# Altium schematic sheet main.SchDoc
size A4
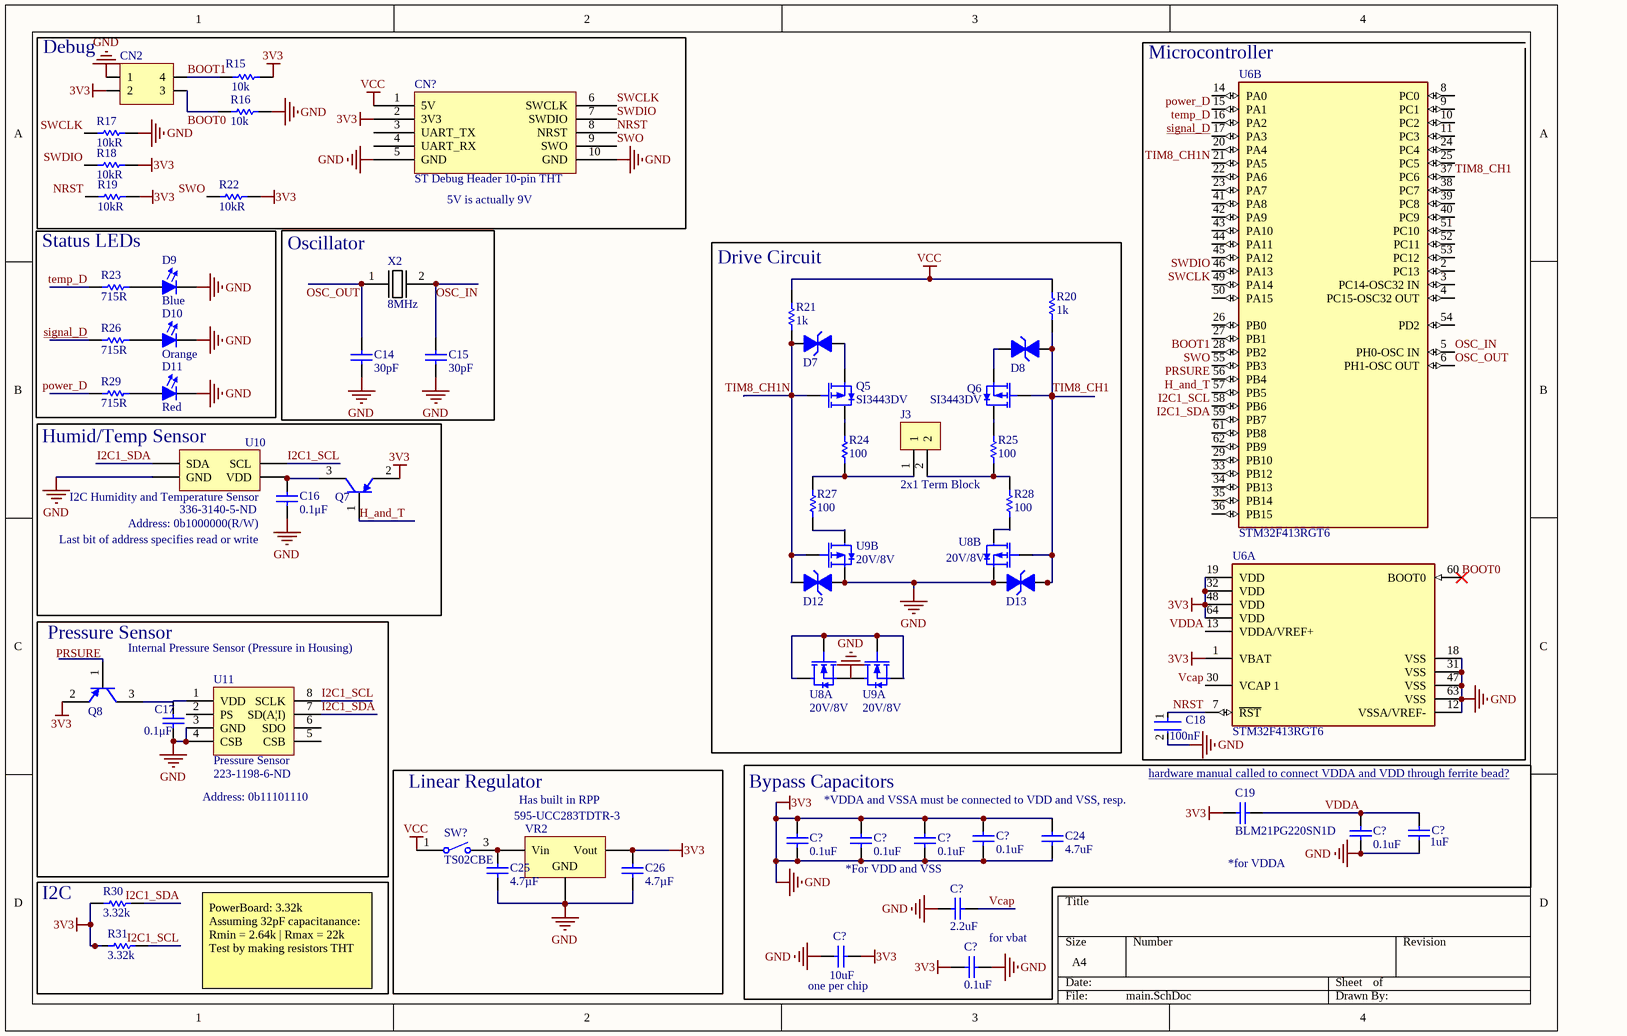
[diagram p0: main.SchDoc]

## Parts
(Parts that share a designator on the sheet are numbered #1, #2 ... from top to bottom, then left to right.)
C14  30pF  [CAPC1608N(0603")]
C15  30pF  [CAPC1608N(0603")]
C16  0.1μF  [CAPC1608N(0603")]
C17  0.1μF  [CAPC1608N(0603")]
C18  Capacitance: 100nF  [FP-CL10-0_1-MFG]  (hidden comment: CL10B104JB8NNNC)
C19  BLM21PG220SN1D  [CAPC2013X105X50ML20T20]
C24  4.7uF  [CAPC1608N(0603")]
C25  4.7µF  [CAPC2012N(0805")]
C26  4.7µF  [CAPC2012N(0805")]
C?#1  Capacitance: 0.1uF  [FP-CL10-0_1-MFG]  (hidden comment: CL10B104JB8NNNC)
C?#2  Capacitance: 1uF  [0803 CAP]  (hidden comment: CL21B105KBFNNNG)
C?#3  Capacitance: 0.1uF  [FP-CL10-0_1-MFG]  (hidden comment: CL10B104JB8NNNC)
C?#4  Capacitance: 0.1uF  [FP-CL10-0_1-MFG]  (hidden comment: CL10B104JB8NNNC)
C?#5  Capacitance: 0.1uF  [FP-CL10-0_1-MFG]  (hidden comment: CL10B104JB8NNNC)
C?#6  Capacitance: 0.1uF  [FP-CL10-0_1-MFG]  (hidden comment: CL10B104JB8NNNC)
C?#7  2.2uF  [CAPC1608N(0603")]
C?#8  Capacitance: 10uF  [CAPC3216X180X50LL20T30]  (hidden comment: CL31B106KBHNNNE)
C?#9  Capacitance: 0.1uF  [FP-CL10-0_1-MFG]  (hidden comment: CL10B104JB8NNNC)
CN2  Header, Male, 2x2, Pitch: 0.1" (2.54mm), THT  [Header, Male, 2x2, Pitch: 0.1" (2.54mm),THT]  (value not drawn)
CN?  ST Debug Header 10-pin THT  [10-pin shrouded header THT]
D7  SMBJ24CA  [DO-214AC]  (value not drawn)
D8  SMBJ24CA  [DO-214AC]  (value not drawn)
D9  Blue  [LED0805]
D10  Orange  [LED0805]
D11  Red  [LED0805]
D12  SMBJ24CA  [DO-214AC]  (value not drawn)
D13  SMBJ24CA  [DO-214AC]  (value not drawn)
J3  2x1 Term Block  [2X1 Terminal Blocks Phoenix Contact 5mm]
Q5  SI3443DV  [SuperSOT-6]
Q6  SI3443DV  [SuperSOT-6]
Q7  MMBT3906LT3G  [ONSC-SOT-23-3-318-08_V]  (value not drawn)
Q8  MMBT3906LT3G  [ONSC-SOT-23-3-318-08_V]  (value not drawn)
R15  10k  [RESC1608N(0603")]
R16  10k  [RESC1608N(0603")]
R17  10kR  [RESC1608N(0603")]
R18  10kR  [RESC1608N(0603")]
R19  10kR  [RESC1608N(0603")]
R20  1k  [RESC1608N(0603")]
R21  1k  [RESC1608N(0603")]
R22  10kR  [RESC1608N(0603")]
R23  715R  [RESC1608N(0603")]
R24  100  [RESC1608N(0603")]
R25  100  [RESC1608N(0603")]
R26  715R  [RESC1608N(0603")]
R27  100  [RESC1608N(0603")]
R28  100  [RESC1608N(0603")]
R29  715R  [RESC1608N(0603")]
R30  3.32k  [RESC1608N(0603")]
R31  3.32k  [RESC1608N(0603")]
SW?  TS02CBE  [CKCP-TS02CBE_V]
U6  STM32F413RGT6  [FP-LQFP64-5W-MFG]  (parts A,B of 2)
U8  20V/8V  [SOT-363]  (parts A,B of 2)
U9  20V/8V  [SOT-363]  (parts A,B of 2)
U10  I2C Humidity and Temperature Sensor  Supplier Part Number 1: 336-3140-5-ND  [QFN-6]
U11  Pressure Sensor  Supplier Part Number 1: 223-1198-6-ND  [TE Pressure Sensor (MS560702BA03-50)]
VR2  595-UCC283TDTR-3  [D2PAK_N]
X2  8MHz  [HC49/US]

## Blocks framed on the sheet
Debug: CN2 CN? R15-R19 R22
Status LEDs: D9-D11 R23 R26 R29
Oscillator: C14 C15 X2
Drive Circuit: D7 D8 D12 D13 J3 Q5 Q6 R20 R21 R24 R25 R27 R28 U8 U9
Humid/Temp Sensor: C16 Q7 U10
Pressure Sensor: C17 Q8 U11
Linear Regulator: C25 C26 SW? VR2
Bypass Capacitors: C19 C24 C?#1-C?#9
I2C: R30 R31

## Nets
3V3: C14.1 C15.1 C16.1(Anode) C17.1(Anode) C18.2 C19.1 C24.1(Anode) C24.2(Cathode) C25.1(Anode) C26.1(Anode) C26.2(Cathode) C?#1.1 C?#1.2 C?#2.1 C?#3.1 C?#4.1 C?#4.2 C?#5.1 C?#6.1 C?#6.2 C?#7.1(Anode) C?#8.1 C?#8.2 C?#9.1 C?#9.2 CN2.1 CN2.2 CN?.2(3V3) CN?.5(GND) CN?.10(GND) D9.1(Cathode) D10.1(Cathode) D11.1(Cathode) D12.2(Cathode) D13.2(Cathode) Q7.2(E) Q8.2(E) R15.1 R16.1 R17.2 R18.2 R19.2 R22.2 R30.1 R31.1 U6.1(VBAT) U6.12(VSSA/VREF-) U6.18(VSS) U6.19(VDD) U6.31(VSS) U6.32(VDD) U6.47(VSS) U6.48(VDD) U6.63(VSS) U6.64(VDD) U8.1(S1) U8.4(S2) U9.4(S2) U10.2(GND) U11.3(GND) U11.4(CSB) VR2.2(GND) VR2.3(Vout)  [also labelled GND]
VCC: CN?.1(5V) R20.2 R21.2 SW?.1
BOOT0: CN2.3 R16.2 U6.60(BOOT0)
BOOT1: CN2.4 R15.2 U6.28(PB2)
H_and_T: Q7.1(B) U6.57(PB5)
I2C1_SCL: R31.2 U6.58(PB6) U10.6(SCL) U11.8(SCLK)
I2C1_SDA: R30.2 U6.59(PB7) U10.1(SDA) U11.7(SD(A|I))
NRST: C18.1 CN?.8(NRST) R19.1 U6.7(~{RST})
OSC_IN: C15.2 U6.5(PH0-OSC_IN) X2.2
OSC_OUT: C14.2 U6.6(PH1-OSC_OUT) X2.1
power_D: R29.1 U6.15(PA1)
PRSURE: Q8.1(B) U6.56(PB4)
signal_D: R26.1 U6.17(PA3)
SWCLK: CN?.6(SWCLK) R17.1 U6.49(PA14)
SWDIO: CN?.7(SWDIO) R18.1 U6.46(PA13)
SWO: CN?.9(SWO) R22.1 U6.55(PB3)
temp_D: R23.1 U6.16(PA2)
TIM8_CH1: D8.2(Cathode) D13.1(Anode) Q6.3 R20.1 U6.37(PC6) U8.5(G2)
TIM8_CH1N: D7.2(Cathode) D12.1(Anode) Q5.3 R21.1 U6.21(PA5) U9.5(G2)
Vcap: C?#7.2(Cathode) U6.30(VCAP_1)
VDDA: C19.2 C?#2.2 C?#3.2 U6.13(VDDA/VREF+)
NetC16_2: C16.2(Cathode) Q7.3(C) U10.5(VDD)
NetC17_2: C17.2(Cathode) Q8.3(C) U11.1(VDD)
NetC25_2: C25.2(Cathode) SW?.3 VR2.1(Vin)
NetD7_1: D7.1(Anode) Q5.1
NetD8_1: D8.1(Anode) Q6.1
NetD9_2: D9.2(Anode) R23.2
NetD10_2: D10.2(Anode) R26.2
NetD11_2: D11.2(Anode) R29.2
NetJ3_1: J3.1 R24.1 R27.2
NetJ3_2: J3.2 R25.1 R28.2
NetQ5_4: Q5.4 R24.2
NetQ6_4: Q6.4 R25.2
NetR27_1: R27.1 U9.3(D2)
NetR28_1: R28.1 U8.3(D2)
NetU8_2: U8.2(G1) U8.6(D1) U9.1(S1) U9.2(G1)

Not connected (* = marked no-connect by the designer): C?#5 2; CN? 3(UART_TX) 4(UART_RX); U6 2(PC13) 3(PC14-OSC32_IN) 4(PC15-OSC32_OUT) 8(PC0) 9(PC1) 10(PC2) 11(PC3) 14(PA0) 20(PA4) 22(PA6) 23(PA7) 24(PC4) 25(PC5) 26(PB0) 27(PB1) 29(PB10) 33(PB12) 34(PB13) 35(PB14) 36(PB15) 38(PC7) 39(PC8) 40(PC9) 41(PA8) 42(PA9) 43(PA10) 44(PA11) 45(PA12) 50(PA15) 51(PC10) 52(PC11) 53(PC12) 54(PD2) 61(PB8) 62(PB9); U9 6(D1); U11 2(PS) 5(CSB) 6(SDO)

## Notes on the sheet
- (near U6) Microcontroller
- (near CN?) 5V is actually 9V
- (near C16) Last bit of address specifies read or write
- (near C16) Address: 0b1000000(R/W)
- Internal Pressure Sensor (Pressure in Housing)
- hardware manual called to connect VDDA and VDD through ferrite bead? <https://www.st.com/resource/en/application_note/dm00115714-getting-started-with-stm32f4xxxx-mcu-hardware-development-stmicroelectronics.pdf>
- Address: 0b11101110
- Has built in RPP
- *VDDA and VSSA must be connected to VDD and VSS, resp.
- (near C?#4) *For VDD and VSS
- (near C19) *for VDDA
- PowerBoard: 3.32k
  Assuming 32pF capacitanance:
  Rmin = 2.64k | Rmax = 22k
  Test by making resistors THT
- (near C?#8) one per chip
- (near C?#9) for vbat

## Library data of the parts
C14 C15 = CMP-006-0040-1: Capacitor, Ceramic, 50V, +/-1%, 0603 SMD, C0G; Made By: Andy Bates; Design Item ID: 30pF 50V 0603 SMD, Ceramic; Value: 30pF; PackageDescription: Chip Capacitor; Source: AUVic_Schematic_Library_Capacitors.SchLib; Publisher: AUVic; Pin Count: 2; Published: 16-09-12; Component Type: Standard
C16 C17 = 0.1uF 100V 0603 SMD, Ceramic: Capacitor, Ceramic, 100V, +/- 10%, 0603 SMD, X7R; MFG: TDK; MFG#: CGA3E3X7S2A104K080AB; Published: 16-04-26; Publisher: AUVic; PackageDescription: Chip Capacitor; Value: 0.1μF; Created By: Ashwin Sira; Supplier 1: Digi-Key; Supplier Part Number 1: 445-6938-1-ND
C18 = CMP-00000-1: CAP CER 0.1UF 50V X7R 0603; Material: Ceramic; Tolerance: 5%; Dielectric: X7R; Width: 0.031inch; Min Operating Temperature: -55°C; Contact Plating: Tin; Length: 1.6mm; Case/Package: 0603; Package Quantity: 1; Voltage Rating: 50V; Radiation Hardening: No; Packaging: Tape and Reel; Max Operating Temperature: 125°C; Case Code (Imperial): 0603; Thickness: 0.035inch; Case Code (Metric): 1608; Height: 0.8mm; Mount: Surface Mount; Depth: 0.8mm
C19 = CMP-2007-03669-1: Manufacturer: Murata; Part Number: BLM21PG220SN1D
C24 = CMP-006-0043-1: Capacitor, Ceramic, 10V, +/- 10%, 0603 SMD, X5R; Value: 4.7µF; MFG: Samsung; MFG#: GRM188R61A475KE15D; PackageDescription: Chip Capacitor; Source: AUVic_Schematic_Library_Capacitors.SchLib; Published: 16-06-23; Created By: Ashwin Sira; Component Type: Standard; Pin Count: 2; Publisher: AUVic; Design Item ID: 4.7uF 10V 0603 SMD, Ceramic
C25 C26 = 4.7uF 35V 0805 SMD, Ceramic: Capacitor, Ceramic, 35V, +/- 10%, 0805 SMD, X5R; Made By: Andy Bates; Published: 16-11-12; Publisher: AUVic; PackageDescription: Chip Capacitor; Value: 4.7µF; Supplier 1: Digi-Key; Supplier Part Number 1: 1276-6722-1-ND
C?#1 C?#3-C?#6 C?#9 = CMP-00000-3: CAP CER 0.1UF 50V X7R 0603; Tolerance: 5%; Material: Ceramic; Case Code (Imperial): 0603; Mount: Surface Mount; Thickness: 0.035inch; Depth: 0.8mm; Packaging: Tape and Reel; Package Quantity: 1; Dielectric: X7R; Height: 0.8mm; Voltage: 50V; Radiation Hardening: No; Max Operating Temperature: 125°C; Voltage Rating: 50V; Case/Package: 0603; Min Operating Temperature: -55°C; Case Code (Metric): 1608; Length: 1.6mm; Contact Plating: Tin; Width: 0.031inch
C?#2 = CMP-00005-1: SAMSUNG ELECTRO-MECHANICS - CL21B105KBFNNNG - MLCC CAPACITORS; Tolerance: 10%; Voltage Rating: 50V; Material: Ceramic; Dielectric: X7R; Case/Package: 0805; Contact Plating: Tin; Max Operating Temperature: 125°C; Termination: Wraparound; Package Quantity: 3000; Depth: 1.25mm; Mount: Surface Mount; Min Operating Temperature: -55°C; Thickness: 0.053inch; Packaging: Tape and Reel; Case Code (Metric): 2012; Length: 2mm; Case Code (Imperial): 0805; Width: 0.049inch
C?#7 = CMP-006-0030-1: Capacitor, Ceramic, 50V, 10%, 0603 SMD, X5R; Value: 2.2µF; Date Created: *; Design Item ID: 2.2uF, 50V, 0603 SMD, X5R, Ceramic; Made By: *; Publisher: AUVic; Source: AUVic_Schematic_Library_Capacitors.SchLib; Pin Count: 2; PackageDescription: Chip Capacitor; Component Type: Standard
C?#8 = CMP-00004-1: Cap Ceramic 10uF 50V X7R 10% Pad SMD 1206 125°C T/R; Thickness: 0.071inch; Case/Package: 1206; Case Code (Metric): 3216; Case Code (Imperial): 1206; Voltage Rating: 50V; Length: 0.126inch; Max Operating Temperature: 125°C; Voltage Rating (DC): 50V; Dielectric: X7R; Lead Free: Lead Free; Min Operating Temperature: -55°C; Tolerance: 10%; Mount: Surface Mount; Packaging: Tape and Reel; Width: 0.063inch
CN2 = CMP-005-0036-1: Pin Count: 4; Date Published: 2018-01-27; Last Updated: *; Source: AUVic_Schematic_Library_Connectors.SchLib; Design Item ID: Header, Male, 2x2, Pitch: 0.1" (2.54mm), THT; Publisher: AUVic; Reviewed By: *; Created By: Lyden Smith; Component Type: Standard
CN? = CMP-00011-5: CONN HEADER VERT 10POS 2.54MM; Row Spacing: 0.1inch; Connector Type: Male Pin; Number of Positions: 10; Packaging: Tray; Package Quantity: 1; Color: Black; Number of Rows: 2; Termination: Solder; Contact Plating: Gold; Lead Free: Lead Free; Pitch: 0.1inch; Mount: Through Hole
D7 D8 D12 D13 = SMBJ24CA: TVS DIODE 24VWM 38.9VC SMB; Manufacturer: Fairchild Semiconductor; Type: Zener; Bidirectional Channels: 1; Voltage - Reverse Standoff (Typ): 24V; Voltage - Breakdown (Min): 26.7V; Voltage - Clamping (Max) @ Ipp: 38.9V; Current - Peak Pulse (10/1000µs): 15.4A; Power - Peak Pulse: 600W; Power Line Protection: No; Supplier 1: Digi-Key; Manufacturer Part Number: SMBJ24CA; RoHS: RoHS Compliant; Category: Circuit Protection; Stock 1: 31873; Pricing 1: 1=0.58, 10=0.411, 25=0.3372, 100=0.2695, 250=0.19636, 500=0.15946, 1000=0.12257 (USD); Packaging: Cut Tape (CT); Unidirectional Channels: -; Applications: General Purpose; Capacitance @ Frequency: -; Operating Temperature: -55°C ~ 150°C (TJ); Mounting Type: Surface Mount; Package / Case: DO-214AA, SMB; Supplier Device Package: DO-214AA (SMB); ComponentLink1URL: http://www.fairchildsemi.com/datasheets/SM/SMBJ100A.pdf; ComponentLink1Description: http://www.fairchildsemi.com/datasheets/SM/SMBJ100A.pdf; Supplier Part Number 1: SMBJ24CAFSCT-ND
D9 = CMP-057-0008-1: LED, 0805 (2012), Blue, Clear; Colour: Red; Design Item ID: LED, 0805 (2012), Blue, Clear; Component Type: Standard; Pin Count: 2; Source: AUVic_Schematic_Library_Diodes.SchLib; Created By: Ashwin Sira
D10 = CMP-057-0010-1: LED, 0805 (2012), Orange, Clear; Pin Count: 2; Source: AUVic_Schematic_Library_Diodes.SchLib; Component Type: Standard; ComponentLink1Description: Digikey; Colour: Orange; ComponentLink1URL: https://www.digikey.ca/product-detail/en/lite-on-inc/LTST-C170KFKT/160-1413-1-ND/386774; Created By: Robert Keen; Design Item ID: LED, 0805 (2012), Orange, Clear
D11 = CMP-057-0011-1: LED, 0805 (2012), Red, Clear; Design Item ID: LED, 0805 (2012), Red, Clear; Colour: Red; Component Type: Standard; Pin Count: 2; Created By: Ashwin Sira; Source: AUVic_Schematic_Library_Diodes.SchLib
J3 = 2x1 Terminal Block, 20A, 12-20AWG: Made by: Andy Bates; Date Made: 2017-11-14; Supplier 1: Digi-Key; Supplier Part Number 1: 277-6405-ND
Q5 Q6 = SI3443DVFSTR-ND: P-Channel 20V 4A (Ta) 1.6W (Ta) Surface Mount SuperSOT™-6; ComponentLink1Description: Datasheet; ComponentLink1URL: *https://www.onsemi.com/pub/Collateral/SI3443DV-D.PDF; Supplier 1: Digi-Key
Q7 Q8 = CMP-1048-00645-1: General Purpose Transistor, PNP Silicon, 3-Pin SOT-23, Pb-Free, Tape and Reel; Manufacturer: On Semiconductor; fT Min (MHz): 250; IC Continuous (A): -0.2; ComponentLink1URL: http://www.onsemi.com/; ComponentLink2Description: Datasheet; Packing: Tape and Reel; Polarity: PNP; PackageDescription: 3-Pin Small Outline Transistor, Body 2.92 x 1.3 mm, Pitch 0.95 mm; PackageVersion: Rev. AP, 11/2009; ComponentLink1Description: Manufacturer URL; ComponentLink3Description: Package Specification; PackageReference: SOT-23-3-318-08; PartNumber: MMBT3906LT3G; ComponentLink2URL: http://www.onsemi.cn/pub_link/Collateral/MMBT3906LT1-D.PDF; DatasheetVersion: Rev. 11; RoHS: TRUE; ComponentLink3URL: http://www.onsemi.cn/pub_link/Collateral/318-08.PDF; Mounting Technology: Surface Mount
R15 R16 = 10kR, 1%, 1/10W, 0603 SMD: Made By: Ashwin Sira; Owned By: AUVic; Created On: 14-05-31; Last Edited: 14-05-31; Supplier 1: Digi-Key; Supplier Part Number 1: 311-10.0KHRCT-ND; Value: 10k
R17-R19 R22 = CMP-047-0013-1: 10kR, 1%, 1/10W, 0603 SMD; Owned By: AUVic; Made By: Ashwin Sira; Value: 10k; Design Item ID: 10kR, 1%, 1/10W, 0603 SMD; Pin Count: 2; Component Type: Standard; Created On: 14-05-31; Last Edited: 14-05-31; Source: AUVic_Schematic_Library_Resistors.SchLib
R20 R21 = 1kR, 1%, 1/10W , 0603, SMD: Created By: Andy Bates; Publisher: AUVic; Date Created: 2017-05-10; Value: 1k; Supplier 1: Digikey; Supplier Part Number 1: 311-1.00KHRCT-ND
R23 R26 R29 = CMP-047-0066-1: 715R, 1%, 1/10W, 0603, SMD; Design Item ID: 715R, 1%, 1/10W, 0603, SMD; Source: AUVic_Schematic_Library_Resistors.SchLib; Value: 715R; Publisher: AUVic; Created By: Ashwin Sira; Pin Count: 2; Component Type: Standard; Date Created: 2016-06-10
R24 R25 R27 R28 = 100R, 1%, 1/10W, 0603 SMD: Made By: Andy Bates; Owned By: AUVic; Created On: 16-09-10; Last Edited: 16-09-10; Value: 100; Supplier 1: Digi-Key; Supplier Part Number 1: 311-100HRCT-ND
R30 R31 = 3.32k, 1%, 1/10W, 0603, SMD: Created By: Ashwin Sira; Publisher: AUVic; Date Created: 2016-06-25; Value: 3.32k; Supplier 1: Digi-Key; Supplier Part Number 1: RMCF0603FT3K32CT-ND
SW? = CMP-2000-07317-1: Tiny Slide Switch, SPST, 20 V, -30 to 85 degC, 2-Pin THD, RoHS, Bulk; Manufacturer: C&K Components; Product Height (mm): 12.91mm; Actuator Style: TopSlide; Product Length (mm): 10.16mm; Switch Configuration: OFFNoneON; AC Voltage Rating (Max): 20V; Product Depth (mm): 5.08mm; Actuator Material: Nylon; Mounting Technology: ThroughHole; Manufacturer URL: http://www.ckswitches.com/; Type: Tiny; Pole Throw Configuration: SPST; Terminal Type: PCPins; Package Reference: TS02CBE; Package Description: 2-Pin Through Hole Device, Body 10.16 x 5.08 mm; Datasheet Version: 02/2016; Datasheet URL: http://www.ck-components.com/media/1426/ts_12feb16.pdf; Contact Material: CopperAlloy; Housing Material: N/A/StainlessSteel; Operating Temp Range: -30Cto85C; Contact Plating: Gold/Nickel; DC Voltage Rating (Max): 20V; Mounting Style: ThroughHole
U6 = CMP-00006-1: STMICROELECTRONICS - STM32F413RGT6 - MCU, ARM CORTEX-M4, 100MHZ, LQFP-64; Number of I/Os: 50; Oscillator Type: Internal; Peripherals: Brown-out Detect/Reset,POR,PWM,WDT,DMA,LCD; Interface: I2C,SPI,USB,IrDA,MMC,SDIO,UART,USART; Memory Type: FLASH; Memory Size: 1MB; Case/Package: LQFP; Packaging: Tray; Core Architecture: ARM; Min Operating Temperature: -40°C; Max Operating Temperature: 85°C; Frequency: 100MHz
U8 U9 = NTJD4105CT1GOSTR-ND: Mosfet Array N and P-Channel 20V, 8V 630mA, 775mA 270mW Surface Mount SC-88/SC70-6/SOT-363; Supplier 1: Digi-Key; Supplier Part Number 1: NTJD4105CT1GOSCT-ND; ComponentLink1Description: Datasheet; ComponentLink1URL: https://www.onsemi.com/pub/Collateral/NTJD4105C-D.PDF
U10 = Si700XX: Made by: Andy Bates; Supplier 1: Digi-Key; Created on: 2019/09/08
U11 = MS560702BA03-50 Pressure Sensor: 1kPa to 120 kPa; Made by: Andy Bates; Created on: 2017-09-11; Supplier 1: Digi-Key
VR2 = Volt Reg: Voltage Regulator; Published: 24-Mar-1999; LatestRevisionDate: 29-May-2009; LatestRevisionNote: IPC-7351 Footprint Added.; PackageReference: D2PAK; Publisher: Altium Limited; PackageDescription: 3-Pin Transistor Outline Package 2.54 mm Pitch, 15.1 mm Lead Span
X2 = CMP-043-0007-1: 8Mhz 40ESR  16pF -20°C ~ 70°C; Made By: Lyden Smith; Component Type: Standard; Source: AUVic_Schematic_Library_Oscillators.SchLib; Date Made: 2017-09-18; Pin Count: 2; Design Item ID: Oscillator 8MHz 40ESR